# EAGLE design soil-moisture (EAGLE 9.1.3)
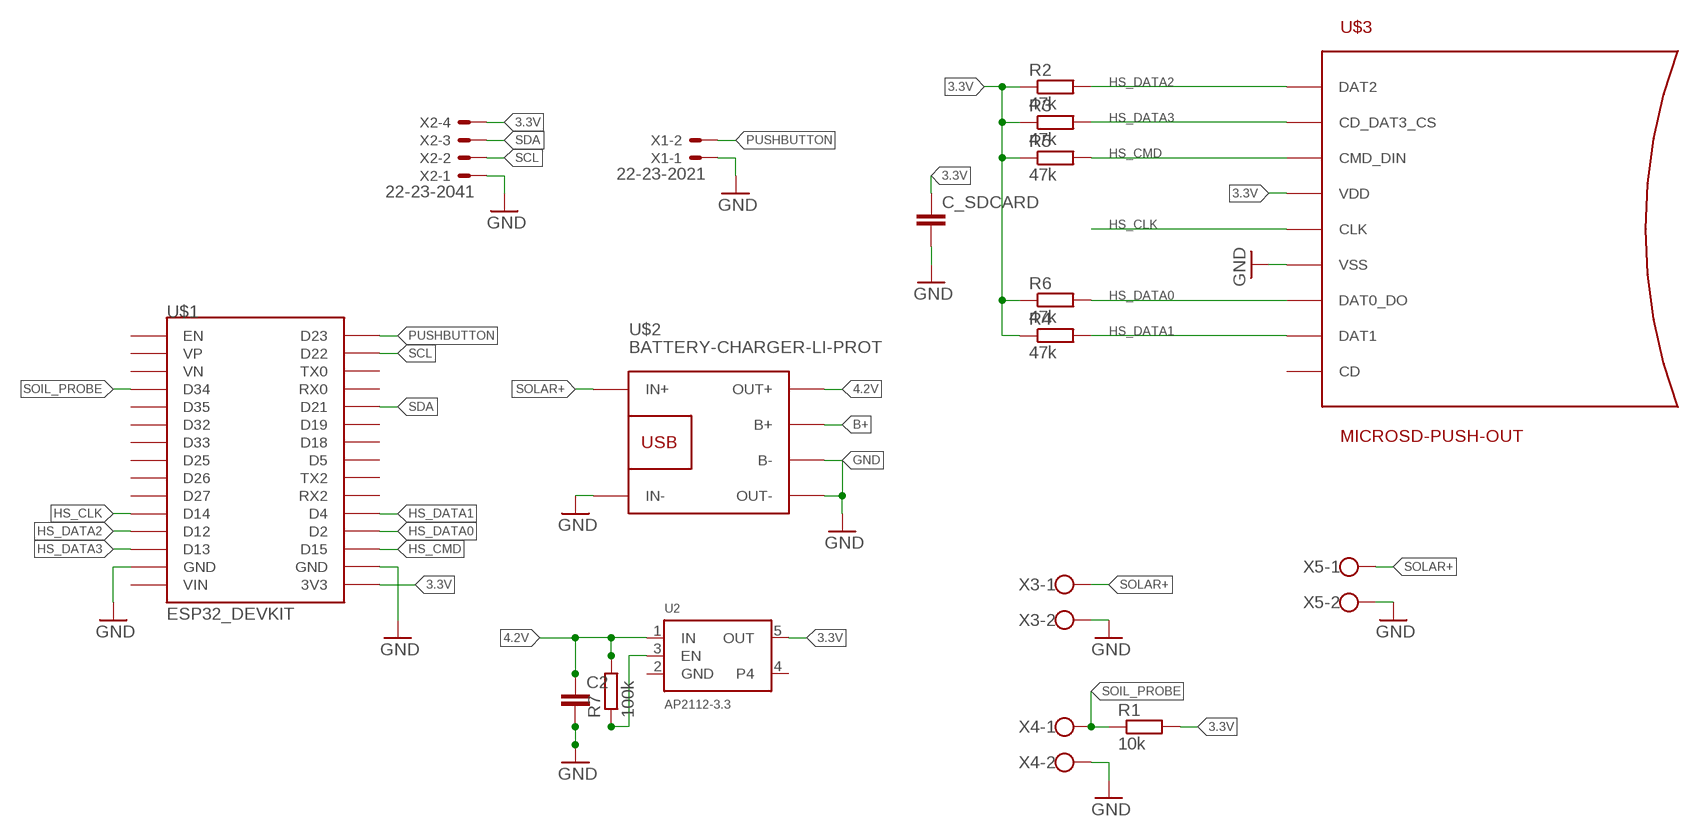
[diagram p0: schematic, sheet 1]

## Parts
C2  C-EUC0805  [C0805]
C_SDCARD  C-EUC0805  [C0805]
R1  10k  R-EU_R0805  [R0805]
R2  47k  R-EU_R0805  [R0805]
R3  47k  R-EU_R0805  [R0805]
R4  47k  R-EU_R0805  [R0805]
R5  47k  R-EU_R0805  [R0805]
R6  47k  R-EU_R0805  [R0805]
R7  100k  R-EU_R0805  [R0805]
U2  AP2112-3.3  VREG_SOT23-5  [SOT23-5]
U$1  ESP32_DEVKIT  [ESP32_DEVKIT]
U$2  BATTERY-CHARGER-LI-PROT  [BATTERY-CHARGER-LI-PROT]
U$3  MICROSD-PUSH-OUT  [MICROSD-PUSH-OUT]
X1  22-23-2021  [22-23-2021]
X2  22-23-2041  [22-23-2041]
X3  W237-102  [W237-102]
X4  W237-102  [W237-102]
X5  W237-102  [W237-102]

## Nets
3.3V: C_SDCARD.1 R1.2 R2.1 R3.1 R4.1 R5.1 R6.1 U2.5(OUT) U$1.3V3 U$3.4(VDD) X2.4
4.2V: C2.1 R7.2 U2.1(IN) U$2.OUT+
B+: U$2.B+
GND: C2.2 C_SDCARD.2 U$1.GND@1(GND) U$1.GND@2(GND) U$2.B- U$2.IN- U$2.OUT- U$3.6(VSS) U$3.G1(VSS) U$3.G2(VSS) U$3.G3(VSS) U$3.G4(VSS) X1.1 X2.1 X3.2 X4.2 X5.2
HS_CLK: U$1.D14 U$3.5(CLK)
HS_CMD: R5.2 U$1.D15 U$3.3(CMD_DIN)
HS_DATA0: R6.2 U$1.D2 U$3.7(DAT0_DO)
HS_DATA1: R4.2 U$1.D4 U$3.8(DAT1)
HS_DATA2: R2.2 U$1.D12 U$3.1(DAT2)
HS_DATA3: R3.2 U$1.D13 U$3.2(CD_DAT3_CS)
N$1: R7.1 U2.3(EN)
PUSHBUTTON: U$1.D23 X1.2
SCL: U$1.D22 X2.2
SDA: U$1.D21 X2.3
SOIL_PROBE: R1.1 U$1.D34 X4.1
SOLAR+: U$2.IN+ X3.1 X5.1
Unconnected: U2.4 U$1.D5 U$1.D18 U$1.D19 U$1.D25 U$1.D26 U$1.D27 U$1.D32 U$1.D33 U$1.D35 U$1.EN U$1.RX0 U$1.RX2 U$1.TX0 U$1.TX2 U$1.VIN U$1.VN U$1.VP U$3.CD

## Power pins joined to a net without a drawn wire
GND: U2.2(GND)

## Library data of the parts
C2 C_SDCARD = rcl:C-EU: CAPACITOR, European symbol; SPICEPREFIX: C
R1-R7 = rcl:R-EU_: RESISTOR, European symbol; SPICEPREFIX: R
U2 = microbuilder:VREG_SOT23-5: SOT23-5 Fixed Voltage Regulators Part Current Out V Out V In V Dropout θJA (°C/W) TJ (°C) Digikey Part No. ADP121 150mA 3.3V 3.4-5.5V 0.09V @ 150mA -- -- ADP121-AUJZ33R7CT-ND ADP121 150mA 3.0V 3.1-5.5V 0.09V @ 150mA -- -- ADP121-AUJZ30R7CT-ND ADP122 300mA 3.3V 3.4-5.5V 0.085V @ 300mA -- -- ADP122AUJZ-3.3-R7CT-ND ADP1712 300mA 3.3V 3.5-5.5V 0.17V @ 300mA -- -- ADP1712AUJZ-3.3-R7TR-ND AP7311 (Low Cost) 150mA 3.3V 3.5-6V 0.15V @ 150mA -- -- AP7311-33WG-7DICT-ND LD39015M18R 150mA 1.8V 1.9V-5.5V 0.08V @ 100mA -- -- 497-6977-1-ND LP2985A-33DBVR 150mA 3.3V 3.3-16V 0.28V @ 150mA 206 150 296-18479-1-ND MCP1824T-3302E/OT 300mA 3.3V 3.5V-6V 0.2V @ 300mA -- -- MCP1824T-3302E/OTCT-ND MIC5205-2.5YM5 TR 150mA 2.5V 2.7-16V 0.165V @ 150mA -- -- 576-1257-2-ND MIC5205-3.0YM5 TR 150mA 3.0V 3.2V-16V 0.165V @ 150mA -- -- 576-1258-2-ND MIC5205-3.3YM5 TR 150mA 3.3V 3.5V-16V 0.165V @ 150mA -- -- 576-1259-2-ND TPS780330220 150mA 3.3V+2.2V 3.6-5.5V 250mV Max -- -- 296-23332-1-ND TDA3663/N1,135 100mA 3.3V 3.5-45V 0.18V @ 50mA -- -- 568-5343-1-ND Max operating temp can be calculated using θJA, TJ (max junction temperature), and power in watts. Set the "Maximum Ambient Temperature" until it reaches TJ ("Max Junction Temperature"), which is the absolute limit for safe use of the regulator: Heat Sink Temperature Calculator <http://www.daycounter.com/Calculators/Heat-Sink-Temperature-Calculator.phtml> For example, With 12V source into a 3.3V LP2985 and a 30mA load, we are dissipating (12V-3.3V) * 0.03A = 0.261W. With a θJA of 206 °C/W, a TJ of 150°C, and 261mW we can safely use the chip without a heat sink up to 75°C (=147.1°C Junction Temperature).
U$1 = DOIT_ESP32_DEVKIT:ESP32_DEVKIT: ESP32 DEVKIT BOARD
U$2 = diy-modules (1):BATTERY-CHARGER-LI-PROT: Lithium Battery 5V Charger with protection circuit More details available here: http://www.instructables.com/id/DIY-Lithium-ion-Battery-Charger/step4/TP4056-based-lithium-ion-battery-charger-module/ Click here to find device on ebay.com <http://www.ebay.com/sch/tp4056+charger+usb+protection>
U$3 = microsd:MICROSD-PUSH-OUT: T-Flash Push-Out Micro SD Card Reader 14.75mm x 14.5mm SMD with external pins
X1 = con-molex:22-23-2021: .100" (2.54mm) Center Header - 2 Pin; MF: MOLEX; MPN: 22-23-2021; OC_FARNELL: 1462926; OC_NEWARK: 25C3832
X2 = con-molex:22-23-2041: .100" (2.54mm) Center Header - 4 Pin; MF: MOLEX; MPN: 22-23-2041; OC_FARNELL: 1462920; OC_NEWARK: 38C0355
X3-X5 = con-wago-500:W237-102: WAGO SCREW CLAMP; MPN: 237-102; OC_FARNELL: unknown; OC_NEWARK: 70K9898

## Board
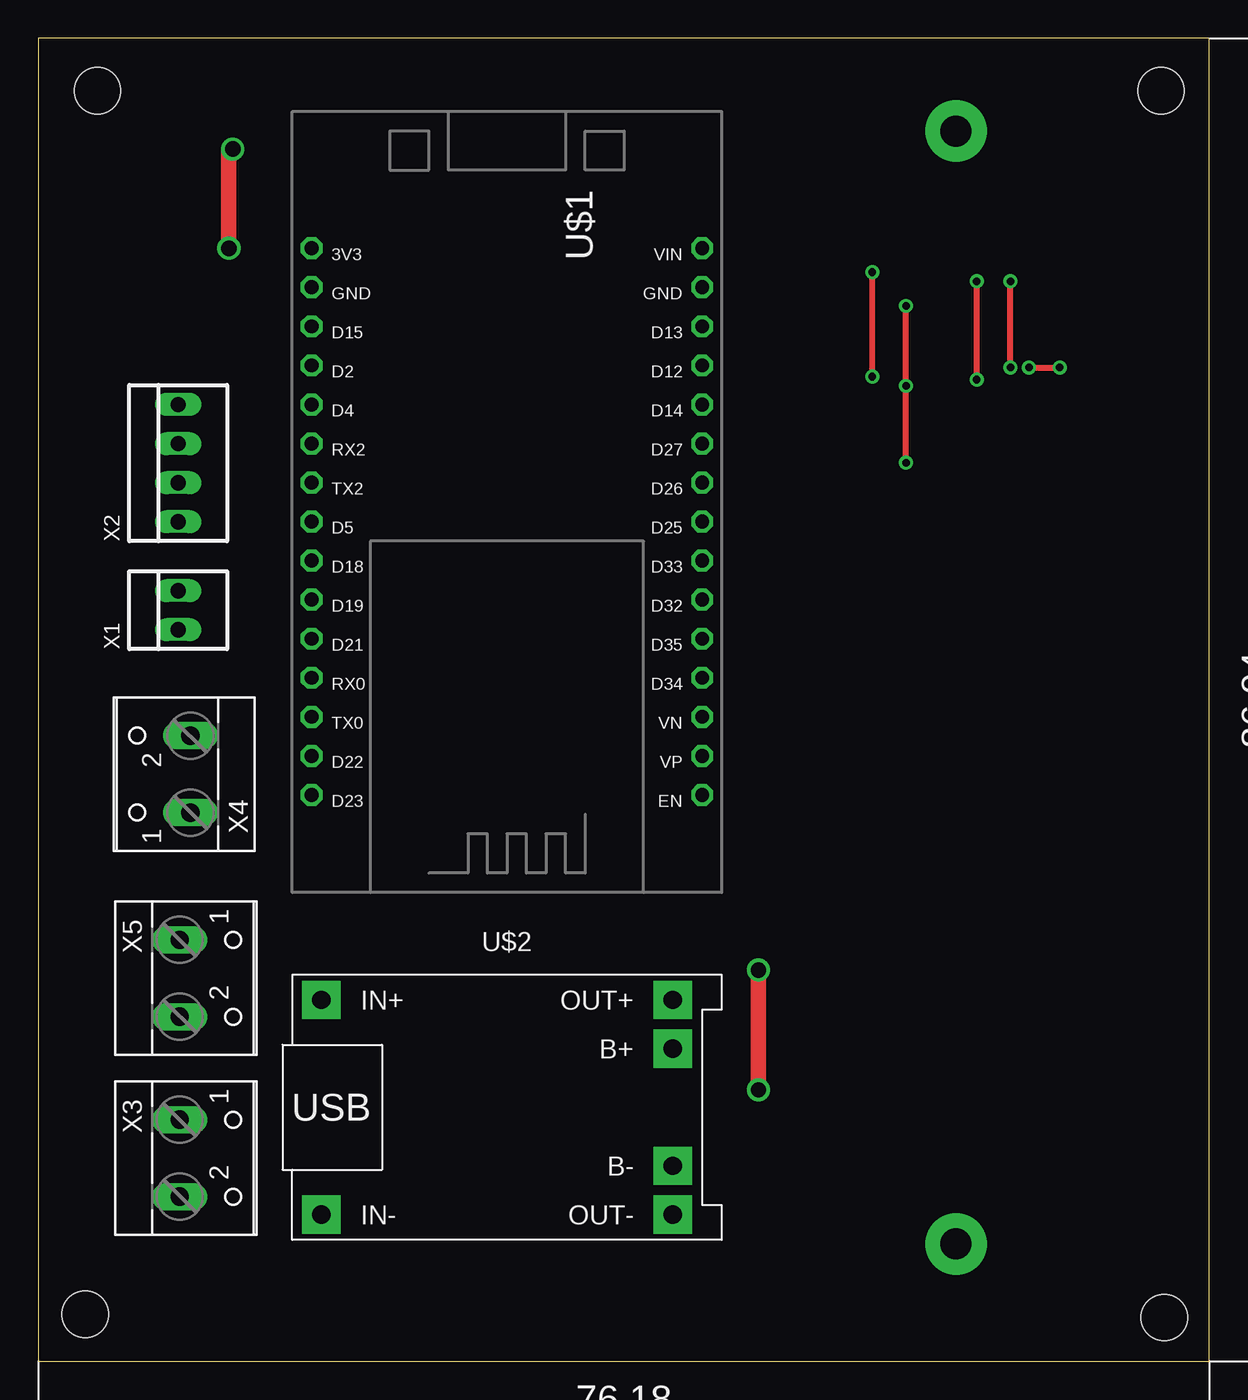
[diagram p1: board, top side]
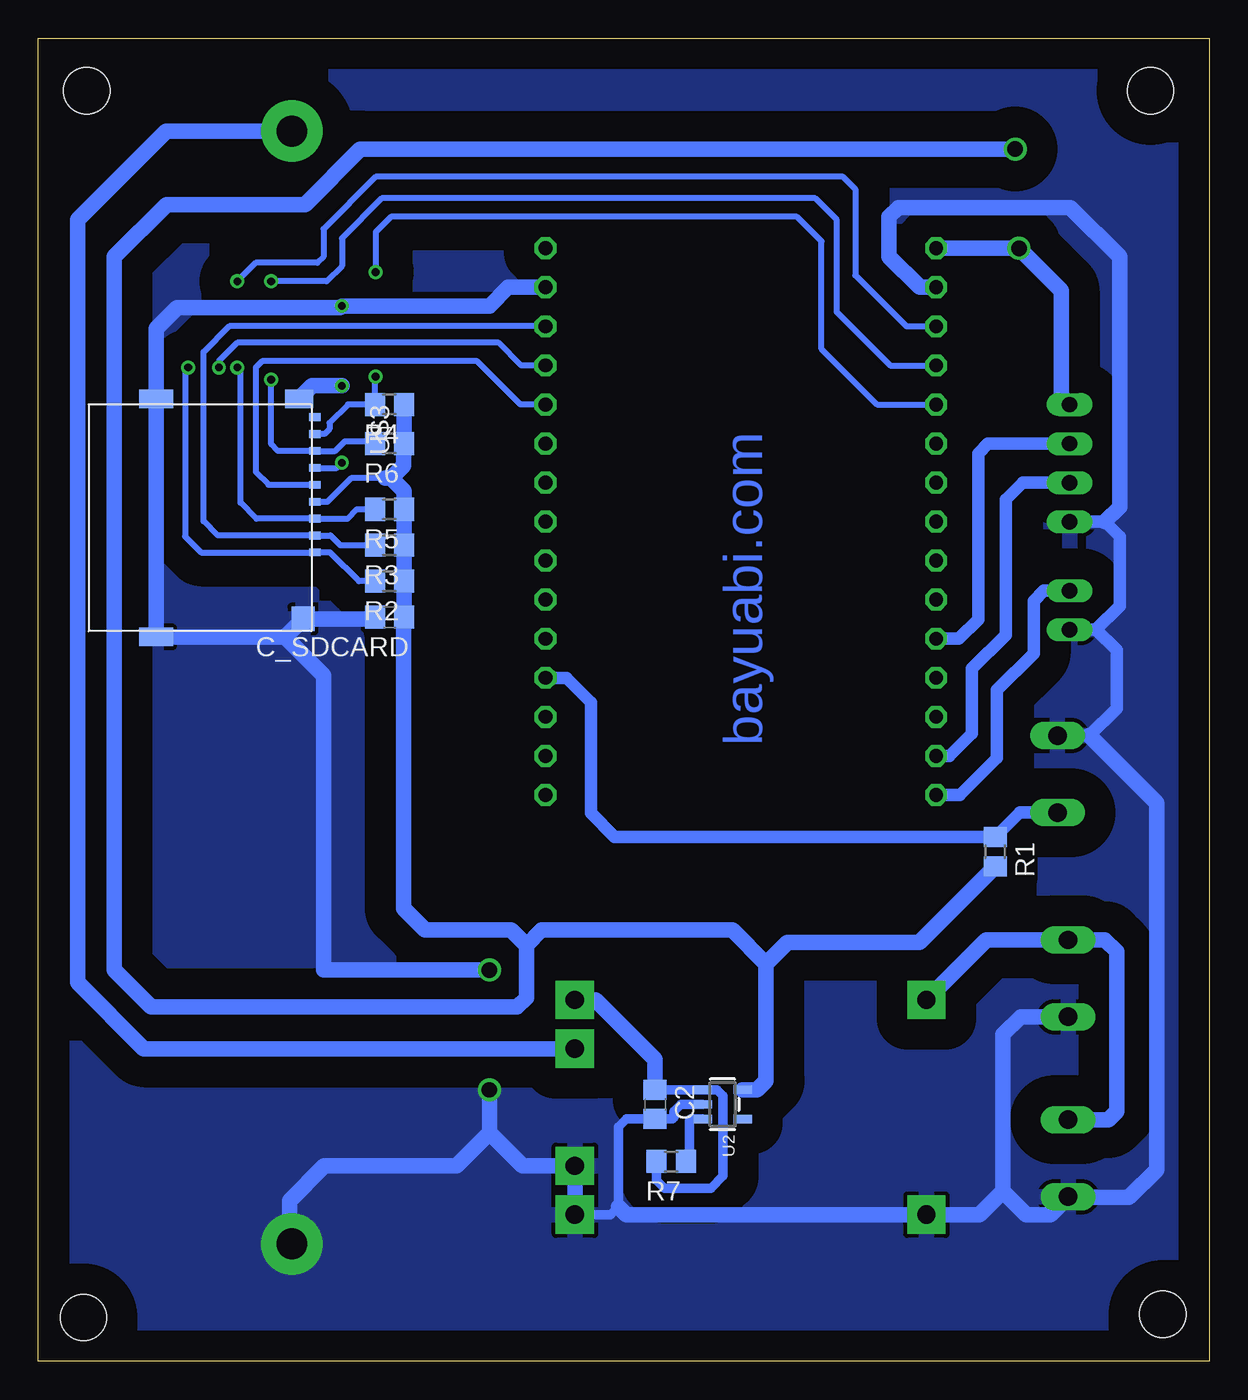
[diagram p2: board, bottom side, seen from below]

Size 76.18 x 86.04 mm. Coordinates in mm from the lower left corner, seen from the top.
Outline: 0,0 76.18,0 76.18,86.04 0,86.04 0,0
Copper layers (1*16): Top 0.035mm / dielectric 1.5mm / Bottom 0.035mm
Design rules "default": minimum track width 6mil, minimum drill 0.35mm, track to track 6mil, track to pad 6mil, pad to pad 6mil, via to via 6mil, smd to smd 6mil, copper to edge 40mil, drill to drill 6mil, minimum pad ring 10mil, minimum via ring 8mil, stop-mask expansion 4mil, vias tented up to drill 0mil, thermal gap 10mil
Holes 3 mm at 3.84,82.64 73.04,82.64 73.24,2.84 3.04,3.04

### Footprints (pad centres in the part's own frame; a part is rotated, then mirrored left to right if it is on the bottom)
C0805 = smd 1.3 x 1.5: 1 -0.95,0; 2 0.95,0
R0805 = smd 1.3 x 1.5: 1 -0.95,0; 2 0.95,0
SOT23-5 = smd 0.55 x 1.2: 1 -0.95,-1.3; 2 0,-1.3; 3 0.95,-1.3; 4 0.95,1.3; 5 -0.95,1.3
ESP32_DEVKIT = drill 0.9 pad 1.422 octagon: 3V3 11.43,-17.78; D2 11.43,-10.16; D4 11.43,-7.62; D5 11.43,0; D12 -13.97,-10.16; D13 -13.97,-12.7; D14 -13.97,-7.62; D15 11.43,-12.7; D18 11.43,2.54; D19 11.43,5.08; D21 11.43,7.62; D22 11.43,15.24; D23 11.43,17.78; D25 -13.97,0; D26 -13.97,-2.54; D27 -13.97,-5.08; D32 -13.97,5.08; D33 -13.97,2.54; D34 -13.97,10.16; D35 -13.97,7.62; EN -13.97,17.78; GND@1 -13.97,-15.24; GND@2 11.43,-15.24; RX0 11.43,10.16; RX2 11.43,-5.08; TX0 11.43,12.7; TX2 11.43,-2.54; VIN -13.97,-17.78; VN -13.97,12.7; VP -13.97,15.24
BATTERY-CHARGER-LI-PROT = drill 1.2 pad 2.5 square: B+ 10.795,3.81; B- 10.795,-3.81; IN+ -12.065,6.985; IN- -12.065,-6.985; OUT+ 10.795,6.985; OUT- 10.795,-6.985
MICROSD-PUSH-OUT = smd 0.5 x 0.75: 1 9.625,0.225; 2 8.525,0.225; 3 7.425,0.225; 4 6.325,0.225; 5 5.225,0.225; 6 4.125,0.225; 7 3.025,0.225; 8 1.925,0.225; CD 0.825,0.225 | smd 1.2 x 1.8: G1 -0.375,-0.8 | smd 1.2 x 2.2: G2 -0.375,-10.1; G4 15.125,-10.1 | smd 1.6 x 1.5: G3 13.95,-0.55
22-23-2021 = drill 1 long: 1 -1.27,0; 2 1.27,0
22-23-2041 = drill 1 long: 1 -3.81,0; 2 -1.27,0; 3 1.27,0; 4 3.81,0
W237-102 = drill 1.194 long: 1 -2.5,-1.27; 2 2.5,-1.27

### Placement (x,y rotation side)
C2  36.06,16.7 270 bottom
C_SDCARD  53.34,48.39 180 bottom
R1  13.93,33.14 270 bottom
R2  53.34,50.73 180 bottom
R3  53.34,53.07 180 bottom
R4  53.34,62.23 180 bottom
R5  53.34,55.41 180 bottom
R6  53.34,59.69 180 bottom
R7  35.01,12.99 180 bottom
U2  31.67,16.7 270 bottom
U$1  29.21,54.61 180 top
U$2  30.48,16.51 0 top
U$3  58.42,62.23 270 bottom
X1  9.09,48.85 90 top
X2  9.09,58.41 90 top
X3  10.46,13.2 270 top
X4  8.62,38.18 90 top
X5  10.46,24.9 270 top

### Tracks (layer width: path | path; a pad name or v marks a point on that pad's centre or on a via)
3.3V  (via drill 1)
  Top 1.016: v12.39,72.39 12.39,78.59 v12.64,78.84
  Bottom 0.406: U$3.4 57.38,55.91 55.84,57.44 53.64,57.44
  Bottom 1.016: R4.1 R6.1 52.44,59.64 52.44,58.24 53.24,57.44 | 53.24,57.44 53.64,57.44 | 53.24,57.44 52.39,56.59 R5.1 R3.1 R2.1 C_SDCARD.1 52.44,48.34 52.44,29.44 51.04,28.04 45.44,28.04 44.44,27.04 | U2.5 29.43,17.65 28.84,18.24 28.84,25.84 | 28.84,25.84 31.04,28.04 43.44,28.04 44.44,27.04 | U$1.3V3 v12.39,72.39 9.64,69.64 9.64,62.77 X2.4 | R1.2 18.88,27.24 27.44,27.24 28.84,25.84 | v12.64,78.84 55.24,78.84 58.84,75.24 67.84,75.24 71.24,71.84 71.24,25.44 68.84,23.04 45.04,23.04 44.44,23.64 44.44,27.04
4.2V
  Bottom 0.61: C2.1 U2.1 32.05,17.65 31.64,17.24 31.64,12.04 32.44,11.24 35.44,11.24 35.96,11.76 R7.2
  Bottom 1.016: C2.1 36.06,19.62 39.94,23.5 U$2.OUT+
B+  (via drill 2 pad 4)
  Bottom 1.016: v59.69,80.01 67.87,80.01 73.64,74.24 73.64,24.64 69.32,20.32 U$2.B+
GND  (via drill 0.5, 1, 2 pad 4)
  Top 0.406: v56.44,58.44 v56.44,63.44 v56.44,68.64
  Top 1.016: v46.84,25.44 v46.84,17.64
  Bottom 0.406: U$3.6 56.78,58.11 v56.44,58.44
  Bottom 0.61: U2.2 34.38,16.7 34.84,16.24 34.84,15.84 34.93,15.75 C2.2 37.93,15.75 38.44,15.24 38.44,10.04 38.95,9.52 U$2.OUT-
  Bottom 0.813: X4.2 7.8,40.68 6.04,42.44 6.04,46.24 7.38,47.58 | 7.38,47.58 X1.1 | 7.38,47.58 | X2.1 6.8,54.6 5.84,53.64 5.84,49.12 7.38,47.58
  Bottom 1.016: C_SDCARD.2 54.4,48.28 U$3.G3 60.15,47.11 | v56.44,63.44 58.39,63.44 U$3.G1 | 60.15,47.11 U$3.G4 U$3.G2 68.52,67.16 67.14,68.54 56.54,68.54 v56.44,68.64 46.84,68.64 45.63,69.85 U$1.GND@1 | v59.69,7.62 59.84,7.77 59.84,10.44 57.58,12.7 48.98,12.7 46.84,14.84 | X5.2 12.28,22.4 13.44,21.24 13.44,11.04 | 13.44,11.04 11.93,9.52 10.36,9.52 X3.2 9.13,10.64 5.24,10.64 3.44,12.44 3.44,36.32 7.8,40.68 | 13.44,11.04 14.95,9.52 U$2.IN- 37.92,9.52 38.44,10.04 | U$2.OUT- U$2.B- 44.7,12.7 46.84,14.84 | U$1.GND@2 18.85,69.85 20.84,71.84 20.84,74.44 20.24,75.04 9.04,75.04 5.84,71.84 5.84,55.56 6.8,54.6 | 60.15,47.11 | 60.15,47.11 57.64,44.6 57.64,25.44 v46.84,25.44 | v46.84,17.64 46.84,14.84 | 46.84,14.84 46.44,14.44
  pour Bottom (isolate 2): 1.24,84.84 74.84,84.84 74.84,1.44 1.64,1.44 1.64,84.44
HS_CLK
  Bottom 0.406: U$1.D14 44.83,62.23 47.64,65.04 61.64,65.04 62.04,64.64 62.04,57.84 61.2,57.01 U$3.5
HS_CMD  (via drill 0.5)
  Top 0.406: v63.24,64.64 v63.24,70.24
  Bottom 0.406: R5.2 55.47,55.41 56.08,54.81 U$3.3 62.01,54.81 63.04,55.84 63.04,64.44 v63.24,64.64 | U$1.D15 19.71,67.31 23.04,70.64 23.04,76.24 23.84,77.04 54.24,77.04 57.64,73.64 57.64,71.84 58.04,71.44 62.04,71.44 v63.24,70.24
HS_DATA0  (via drill 0.5)
  Top 0.406: v61.04,63.84 v61.04,70.24
  Bottom 0.406: R6.2 54.44,59.84 56.24,59.84 56.88,59.2 U$3.7 60.61,59.2 61.04,59.64 v61.04,63.84 | U$1.D2 20.77,64.77 24.24,68.24 24.24,74.24 25.64,75.64 53.84,75.64 56.44,73.04 56.44,71.24 57.44,70.24 v61.04,70.24
HS_DATA1  (via drill 0.5)
  Top 0.406: v54.24,64.04 v54.24,70.84
  Bottom 0.406: U$3.8 57.58,60.31 57.24,60.64 57.24,61.04 56.05,62.23 R4.2 54.29,63.99 v54.24,64.04 | U$1.D4 21.63,62.23 25.24,65.84 25.24,72.84 26.84,74.44 53.24,74.44 54.24,73.44 v54.24,70.84
HS_DATA2  (via drill 0.5)
  Top 0.406: v64.44,64.64 v66.44,64.64
  Bottom 0.406: R2.2 55.33,50.73 57.2,52.61 U$3.1 65.61,52.61 66.64,53.64 66.64,64.44 v66.44,64.64 | U$1.D12 44.77,64.77 46.24,66.24 63.24,66.24 64.44,65.04 v64.44,64.64
HS_DATA3
  Bottom 0.406: U$1.D13 63.77,67.31 65.44,65.64 65.44,54.64 64.51,53.7 U$3.2 57.17,53.7 56.54,53.07 R3.2
N$1
  Bottom 0.61: U2.3 33.73,15.75 33.84,15.64 33.84,13.21 R7.1
PUSHBUTTON
  Bottom 0.813: X1.2 10.76,50.12 11.44,49.44 11.44,46.04 13.84,43.64 13.84,39.24 16.25,36.83 U$1.D23
SCL
  Bottom 0.813: X2.2 12.14,57.14 13.24,56.04 13.24,47.24 15.44,45.04 15.44,40.84 16.91,39.37 U$1.D22
SDA
  Bottom 0.813: X2.3 14.4,59.68 15.04,59.04 15.04,48.24 16.29,46.99 U$1.D21
SOIL_PROBE
  Bottom 0.813: X4.1 12.34,35.68 R1.1 38.69,34.09 40.24,35.64 40.24,42.84 41.84,44.44 U$1.D34
SOLAR+
  Bottom 1.016: X3.1 6.58,15.7 6.04,16.24 6.04,26.64 6.8,27.4 X5.1 14.51,27.4 U$2.IN+

### Text on the board
Bottom: bayuabi.com